# EAGLE design pedal pre (EAGLE 7.4.0)
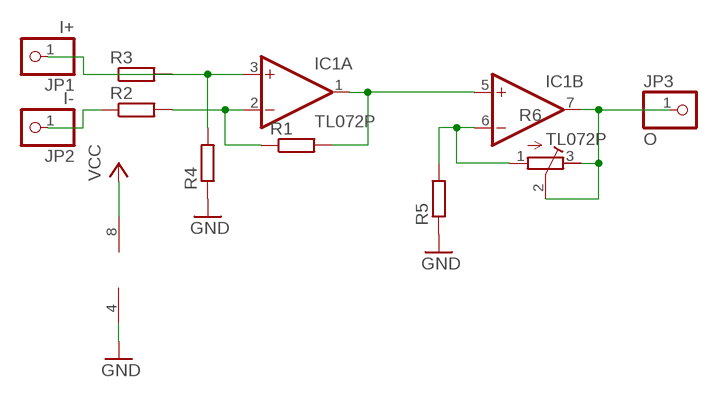
[diagram p0: schematic, sheet 1]

## Parts
IC1  TL072P  [DIL08]
JP1  I+  PINHD-1X1  [1X01]
JP2  I-  PINHD-1X1  [1X01]
JP3  O  PINHD-1X1  [1X01]
R1  R-EU_0207/2V  [0207/2V]
R2  R-EU_0207/2V  [0207/2V]
R3  R-EU_0207/2V  [0207/2V]
R4  R-EU_0207/2V  [0207/2V]
R5  R-EU_0207/2V  [0207/2V]
R6  R-TRIMM64W  [RTRIM64W]

## Nets
GND: IC1.4(P:V-) R4.1 R5.1
N$1: IC1.3(A:+IN) R3.1 R4.2
N$2: IC1.2(A:-IN) R1.1 R2.2
N$3: IC1.1(A:OUT) IC1.5(B:+IN) R1.2
N$4: IC1.6(B:-IN) R5.2 R6.1(A)
N$5: IC1.7(B:OUT) JP3.1 R6.2(S) R6.3(E)
N$6: JP1.1 R3.2
N$7: JP2.1 R2.1
VCC: IC1.8(P:V+)

## Library data of the parts
IC1 = linear:TL072: OP AMP
JP1-JP3 = pinhead:PINHD-1X1: PIN HEADER
R1-R5 = rcl:R-EU_: RESISTOR, European symbol
R6 = rcl:R-TRIMM: Trimm resistor

## Board
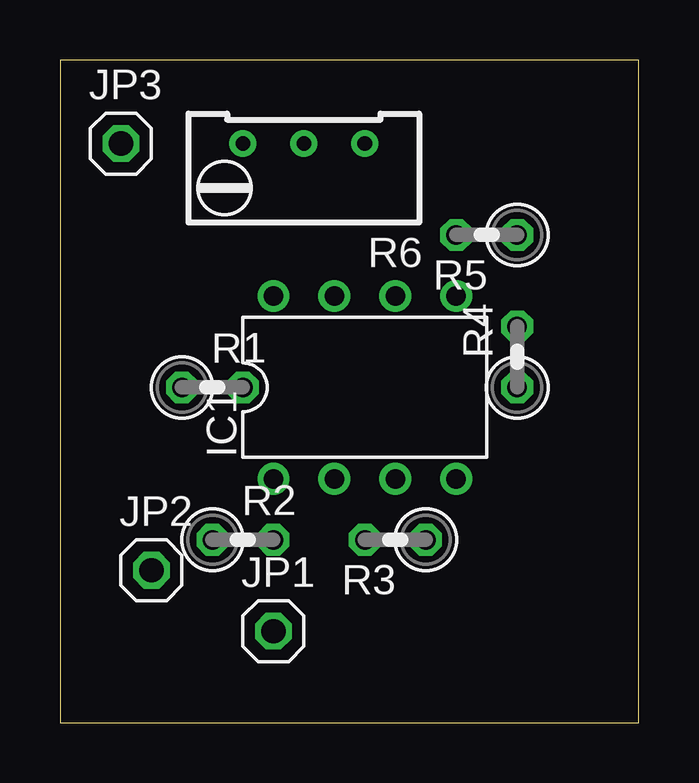
[diagram p1: board, top side]
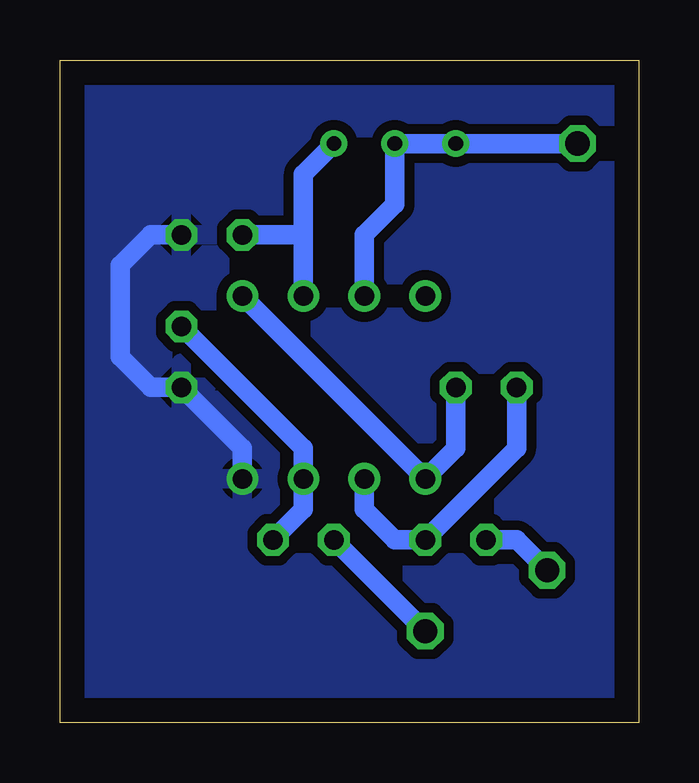
[diagram p2: board, bottom side, seen from below]

Size 24.11 x 27.61 mm. Coordinates in mm from the lower left corner, seen from the top.
Outline: 0,0 24.11,0 24.11,27.61 0,27.61 0,0
Copper layers (1*16): Top 0.035mm / dielectric 1.5mm / Bottom 0.035mm
Design rules "default": minimum track width 10mil, minimum drill 24mil, track to track 8mil, track to pad 8mil, pad to pad 8mil, via to via 8mil, smd to smd 8mil, copper to edge 40mil, drill to drill 8mil, minimum pad ring 10mil, minimum via ring 8mil, stop-mask expansion 4mil, vias tented up to drill 0mil, thermal gap 10mil

### Footprints (pad centres in the part's own frame; a part is rotated, then mirrored left to right if it is on the bottom)
DIL08 = drill 0.813 pad 1.27: 1 -3.81,-3.81; 2 -1.27,-3.81; 3 1.27,-3.81; 4 3.81,-3.81; 5 3.81,3.81; 6 1.27,3.81; 7 -1.27,3.81; 8 -3.81,3.81
1X01 = drill 1.016 octagon: 1 0,0
0207/2V = drill 0.813 octagon: 1 -1.27,0; 2 1.27,0
RTRIM64W = drill 0.61: 1 1.27,-2.54; 2 1.27,0; 3 1.27,2.54

### Placement (x,y rotation side)
IC1  12.7,13.97 0 top
JP1  8.89,3.81 0 top
JP2  3.81,6.35 0 top
JP3  2.54,24.13 0 top
R1  6.35,13.97 0 top
R2  7.62,7.62 0 top
R3  13.97,7.62 180 top
R4  19.05,15.24 90 top
R5  17.78,20.32 180 top
R6  10.16,22.86 90 top

### Tracks (layer width: path | path; a pad name or v marks a point on that pad's centre or on a via)
GND
  Bottom 0.813: IC1.4 16.51,11.43 R4.1 20.32,13.97 21.59,15.24 21.59,19.05 20.32,20.32 R5.1
  pour Bottom (isolate 0.406): 0,27.94 24.13,27.94 24.13,0 0,0
N$1
  Bottom 0.813: R4.2 13.97,11.43 IC1.3 13.97,8.89 R3.1
N$2
  Bottom 0.813: IC1.2 11.43,8.89 10.16,7.62 R2.2 5.08,11.43 R1.1
N$3
  Bottom 0.813: IC1.5 IC1.1 7.62,11.43 R1.2
N$4
  Bottom 0.813: IC1.6 13.97,20.32 | 13.97,20.32 13.97,22.86 R6.1 | R5.2 13.97,20.32
N$5
  Bottom 0.813: IC1.7 11.43,20.32 10.16,21.59 R6.2 R6.3 JP3.1
N$6
  Bottom 0.813: JP1.1 R3.2
N$7
  Bottom 0.813: R2.1 5.08,7.62 JP2.1